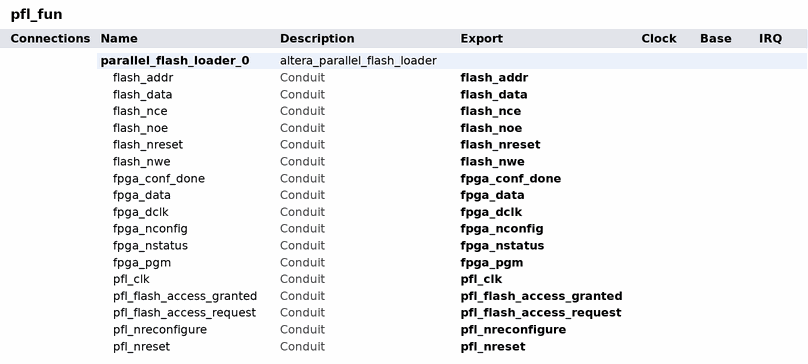
[diagram p0: system contents]
# Platform Designer (Qsys) system pfl_fun, MAX II EPM2210GF256C3
# Parameters at their usual value, and those the tool derives, are not listed.
package require -exact qsys 14.0
create_system pfl_fun
set_project_property DEVICE_FAMILY {MAX II}
set_project_property DEVICE EPM2210GF256C3

add_instance parallel_flash_loader_0 altera_parallel_flash_loader 14.0
set_instance_property parallel_flash_loader_0 AUTO_EXPORT true
set_instance_parameter_value parallel_flash_loader_0 operating_mode_combo {Flash Programming and FPGA Configuration}
set_instance_parameter_value parallel_flash_loader_0 flash_type_combo {CFI Parallel Flash}
set_instance_parameter_value parallel_flash_loader_0 TRISTATE_CHECKBOX true
set_instance_parameter_value parallel_flash_loader_0 num_flash_combo 1
set_instance_parameter_value parallel_flash_loader_0 flash_device_combo {CFI 512 Mbit}
set_instance_parameter_value parallel_flash_loader_0 flash_data_width_combo {16 bits}
set_instance_parameter_value parallel_flash_loader_0 flash_nreset_check true
set_instance_parameter_value parallel_flash_loader_0 num_qflash_combo 4
set_instance_parameter_value parallel_flash_loader_0 qflash_size_combo {EPCQ 16 Mbit}
set_instance_parameter_value parallel_flash_loader_0 qflash_mfc_combo Macronix
set_instance_parameter_value parallel_flash_loader_0 QFLASH_FAST_SPEED false
set_instance_parameter_value parallel_flash_loader_0 qspi_size_combo {QSPI 8 Mbit}
set_instance_parameter_value parallel_flash_loader_0 num_nflash_combo 1
set_instance_parameter_value parallel_flash_loader_0 nflash_mfc_combo {Micron(NAND)}
set_instance_parameter_value parallel_flash_loader_0 nflash_device_combo {NAND 512 Mbit}
set_instance_parameter_value parallel_flash_loader_0 nflash_data_width_combo {8 bits}
set_instance_parameter_value parallel_flash_loader_0 nflash_rb_edit 0
set_instance_parameter_value parallel_flash_loader_0 FLASH_ECC_CHECKBOX false
set_instance_parameter_value parallel_flash_loader_0 enhanced_flash_programming_combo Speed
set_instance_parameter_value parallel_flash_loader_0 fifo_size_combo 16
set_instance_parameter_value parallel_flash_loader_0 disable_crc_check true
set_instance_parameter_value parallel_flash_loader_0 clock_frequency 100.0
set_instance_parameter_value parallel_flash_loader_0 flash_access_time 100
set_instance_parameter_value parallel_flash_loader_0 nflash_access_time 100
set_instance_parameter_value parallel_flash_loader_0 option_bit_address 98304
set_instance_parameter_value parallel_flash_loader_0 fpga_conf_scheme_combo {FPP (fast passive parallel)}
set_instance_parameter_value parallel_flash_loader_0 safe_mode_combo {Retry from fixed address}
set_instance_parameter_value parallel_flash_loader_0 safe_mode_revert_edit 131072
set_instance_parameter_value parallel_flash_loader_0 reconfigure_checkbox true
set_instance_parameter_value parallel_flash_loader_0 rsu_watchdog_checkbox false
set_instance_parameter_value parallel_flash_loader_0 rsu_watchdog_counter_edit 200.0
set_instance_parameter_value parallel_flash_loader_0 dclk_divisor_combo 1
set_instance_parameter_value parallel_flash_loader_0 read_modes_combo {Normal Mode}
set_instance_parameter_value parallel_flash_loader_0 decompressor_combo None

# exported interfaces
add_interface pfl_nreset conduit end
set_interface_property pfl_nreset EXPORT_OF parallel_flash_loader_0.pfl_nreset
add_interface pfl_flash_access_granted conduit end
set_interface_property pfl_flash_access_granted EXPORT_OF parallel_flash_loader_0.pfl_flash_access_granted
add_interface pfl_flash_access_request conduit end
set_interface_property pfl_flash_access_request EXPORT_OF parallel_flash_loader_0.pfl_flash_access_request
add_interface flash_addr conduit end
set_interface_property flash_addr EXPORT_OF parallel_flash_loader_0.flash_addr
add_interface flash_data conduit end
set_interface_property flash_data EXPORT_OF parallel_flash_loader_0.flash_data
add_interface flash_nce conduit end
set_interface_property flash_nce EXPORT_OF parallel_flash_loader_0.flash_nce
add_interface flash_nwe conduit end
set_interface_property flash_nwe EXPORT_OF parallel_flash_loader_0.flash_nwe
add_interface flash_noe conduit end
set_interface_property flash_noe EXPORT_OF parallel_flash_loader_0.flash_noe
add_interface pfl_clk conduit end
set_interface_property pfl_clk EXPORT_OF parallel_flash_loader_0.pfl_clk
add_interface fpga_pgm conduit end
set_interface_property fpga_pgm EXPORT_OF parallel_flash_loader_0.fpga_pgm
add_interface fpga_conf_done conduit end
set_interface_property fpga_conf_done EXPORT_OF parallel_flash_loader_0.fpga_conf_done
add_interface fpga_nstatus conduit end
set_interface_property fpga_nstatus EXPORT_OF parallel_flash_loader_0.fpga_nstatus
add_interface fpga_data conduit end
set_interface_property fpga_data EXPORT_OF parallel_flash_loader_0.fpga_data
add_interface fpga_dclk conduit end
set_interface_property fpga_dclk EXPORT_OF parallel_flash_loader_0.fpga_dclk
add_interface fpga_nconfig conduit end
set_interface_property fpga_nconfig EXPORT_OF parallel_flash_loader_0.fpga_nconfig
add_interface pfl_nreconfigure conduit end
set_interface_property pfl_nreconfigure EXPORT_OF parallel_flash_loader_0.pfl_nreconfigure
add_interface flash_nreset conduit end
set_interface_property flash_nreset EXPORT_OF parallel_flash_loader_0.flash_nreset

set_interconnect_requirement {$system} qsys_mm.clockCrossingAdapter HANDSHAKE
set_interconnect_requirement {$system} qsys_mm.maxAdditionalLatency 1
set_interconnect_requirement {$system} qsys_mm.insertDefaultSlave FALSE

save_system pfl_fun.qsys
